# EAGLE design dynafeather (EAGLE 9.6.1)
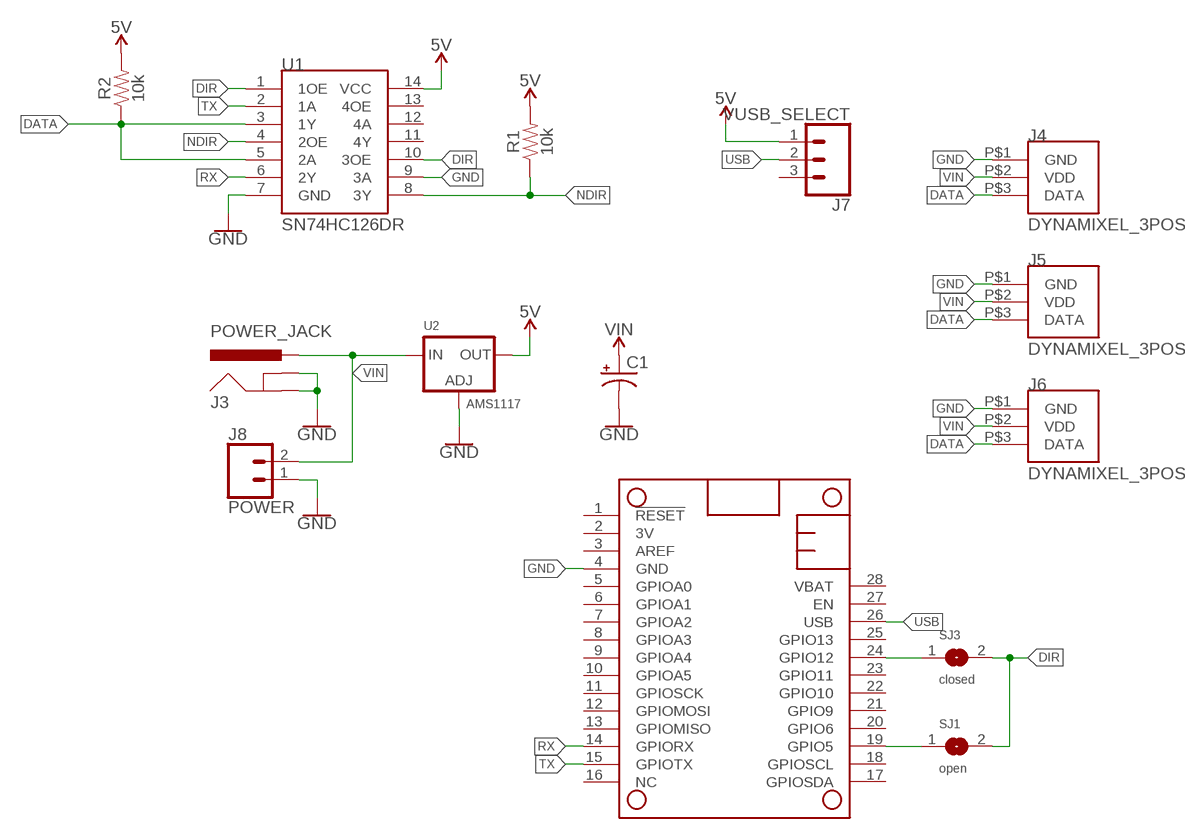
[diagram p0: schematic, sheet 1]

## Parts
C1  ALUM_CAP_0605  [153CLV-0605]
J3  POWER_JACK  [POWER_JACK_PTH]
J4  DYNAMIXEL_3POS  [CONN-MSPOX-3POS]
J5  DYNAMIXEL_3POS  [CONN-MSPOX-3POS]
J6  DYNAMIXEL_3POS  [CONN-MSPOX-3POS]
J7  VUSB_SELECT  CONN_03LOCK  [1X03_LOCK]
J8  POWER  CONN_023.5MM  [SCREWTERMINAL-3.5MM-2]
MS1  FEATHERWING  [FEATHERWING]
R1  10k  10KOHM-0603-1/10W-1%  [0603]
R2  10k  10KOHM-0603-1/10W-1%  [0603]
SJ1  open  SOLDERJUMPERREFLOW  [SOLDERJUMPER_REFLOW]
SJ3  closed  SOLDERJUMPERCLOSED  [SOLDERJUMPER_CLOSEDWIRE]
U1  SN74HC126DR  [SOP14]
U2  AMS1117  LM1117SOT223-REFLOW  [SOT223-R]

## Nets
5V: J7.1 R1.2 R2.2 U1.14(VCC) U2.2(OUT) U2.4(OUT)
DATA: J4.P$3(DATA) J5.P$3(DATA) J6.P$3(DATA) R2.1 U1.3(1Y) U1.5(2A)
DIR: SJ1.2 SJ3.2 U1.1(1OE) U1.10(3OE)
GND: C1.- J3.GND J3.GNDBREAK J4.P$1(GND) J5.P$1(GND) J6.P$1(GND) J8.1 MS1.4(GND) U1.7(GND) U1.9(3A) U2.1(ADJ)
N$3: MS1.24(GPIO12) SJ3.1
N$4: MS1.19(GPIO5) SJ1.1
NDIR: R1.1 U1.4(2OE) U1.8(3Y)
RX: MS1.14(GPIORX) U1.6(2Y)
TX: MS1.15(GPIOTX) U1.2(1A)
USB: J7.2 MS1.26(USB)
VIN: C1.+ J3.PWR J4.P$2(VDD) J5.P$2(VDD) J6.P$2(VDD) J8.2 U2.3(IN)
Unconnected: J7.3 MS1.1(!RESET) MS1.2(3V) MS1.3(AREF) MS1.5(GPIOA0) MS1.6(GPIOA1) MS1.7(GPIOA2) MS1.8(GPIOA3) MS1.9(GPIOA4) MS1.10(GPIOA5) MS1.11(GPIOSCK) MS1.12(GPIOMOSI) MS1.13(GPIOMISO) MS1.16(NC) MS1.17(GPIOSDA) MS1.18(GPIOSCL) MS1.20(GPIO6) MS1.21(GPIO9) MS1.22(GPIO10) MS1.23(GPIO11) MS1.25(GPIO13) MS1.27(EN) MS1.28(VBAT) U1.11(4Y) U1.12(4A) U1.13(4OE)

## Library data of the parts
C1 = HieroLib:ALUM_CAP_0605
J3 = SparkFun-Connectors:POWER_JACK: Power Jack Connector This is the standard 5.5mm barrel jack for power. The PTH is the most common, proven, reliable, footprint. The Slot footprint only works if the mill layer is transmitted to the PCB fab house so be warned. Here are the connectors we sell at SparkFun: DC Barrel Power Jack/Connector <https://www.sparkfun.com/products/119> (PRT-00119) DC Barrel Power Jack/Connector (SMD) <https://www.sparkfun.com/products/12748> (PRT-12748) DC Barrel Jack Adapter - Breadboard Compatible <https://www.sparkfun.com/products/10811> (PRT-10811) It is used on this SparkFun product (and many, many others): SparkFun RedBoard - Programmed with Arduino <https://www.sparkfun.com/products/12757> (DEV-12757) Also, if you need a mating power supply or connector, please check these out: Wall Adapter Power Supply - 9VDC 650mA <https://www.sparkfun.com/products/298> (TOL-00298) DC Barrel Jack Adapter - Male <https://www.sparkfun.com/products/10287> (PRT-10287); PROD_ID: CONN-08197
J4-J6 = HieroLib:DYNAMIXEL_3POS: Dynamixel plug with named pins
J7 = SparkFun-Connectors:CONN_03: Multi connection point. Often used as Generic Header-pin footprint for 0.1 inch spaced/style header connections On any of the 0.1 inch spaced packages, you can populate with these: Break Away Headers - Straight <https://www.sparkfun.com/products/116> (PRT-00116) Break Away Male Headers - Right Angle <https://www.sparkfun.com/products/553> (PRT-00553) Female Headers <https://www.sparkfun.com/products/115> (PRT-00115) Break Away Headers - Machine Pin <https://www.sparkfun.com/products/117> (PRT-00117) Break Away Female Headers - Swiss Machine Pin <https://www.sparkfun.com/products/743> (PRT-00743) Stackable Header - 3 Pin (Female, 0.1") <https://www.sparkfun.com/products/13875> (PRT-13875) For SCREWTERMINALS and SPRING TERMINALS visit here: Screw Terimnals on SparkFun.com <https://www.sparkfun.com/search/results?term=Screw+Terminals> (5mm/3.5mm/2.54mm spacing) This device is also useful as a general connection point to wire up your design to another part of your project. Our various solder wires solder well into these plated through hole pads. Hook-Up Wire - Assortment (Stranded, 22 AWG) <https://www.sparkfun.com/products/11375> (PRT-11375) Hook-Up Wire - Assortment (Solid Core, 22 AWG) <https://www.sparkfun.com/products/11367> (PRT-11367) View the entire wire category on our website here <https://www.sparkfun.com/categories/141> Special notes: Molex polarized connector foot print use with SKU : PRT-08232 with associated crimp pins and housings.
J8 = SparkFun-Connectors:CONN_02: Multi connection point. Often used as Generic Header-pin footprint for 0.1 inch spaced/style header connections On any of the 0.1 inch spaced packages, you can populate with these: Break Away Headers - Straight <https://www.sparkfun.com/products/116> (PRT-00116) Break Away Male Headers - Right Angle <https://www.sparkfun.com/products/553> (PRT-00553) Female Headers <https://www.sparkfun.com/products/115> (PRT-00115) Break Away Headers - Machine Pin <https://www.sparkfun.com/products/117> (PRT-00117) Break Away Female Headers - Swiss Machine Pin <https://www.sparkfun.com/products/743> (PRT-00743) For SCREWTERMINALS and SPRING TERMINALS visit here: Screw Terimnals on SparkFun.com <https://www.sparkfun.com/search/results?term=Screw+Terminals> (5mm/3.5mm/2.54mm spacing) This device is also useful as a general connection point to wire up your design to another part of your project. Our various solder wires solder well into these plated through hole pads. Hook-Up Wire - Assortment (Stranded, 22 AWG) <https://www.sparkfun.com/products/11375> (PRT-11375) Hook-Up Wire - Assortment (Solid Core, 22 AWG) <https://www.sparkfun.com/products/11367> (PRT-11367) View the entire wire category on our website here <https://www.sparkfun.com/categories/141> Special notes: Molex polarized connector foot print use with: PRT-08233 with associated crimp pins and housings. 2.54_SCREWTERM for use with PRT-10571. 3.5mm Screw Terminal footprints for PRT-08084 5mm Screw Terminal footprints for use with PRT-08432; PROD_ID: CONN-08399
MS1 = adafruit:FEATHERWING
R1 R2 = SparkFun-Resistors:10KOHM: 10kΩ resistor A resistor is a passive two-terminal electrical component that implements electrical resistance as a circuit element. Resistors act to reduce current flow, and, at the same time, act to lower voltage levels within circuits. - Wikipedia; PROD_ID: RES-00824
SJ1 SJ3 = microbuilder:SOLDERJUMPER: SMD Solder JUMPER Solder the two pads together to create a connection, or remove the solder to break it. REFLOW - Use this footprint for solder paste and reflow ovens. WAVE - Use this footprint for hand-soldering (larger pads). CLOSED - Has a trace between the two pads to ensure it is closed by default. The trace needs to be cut to disable the jumper, and can be closed again by creating a solder bridge between the two pads.
U1 = HieroLib:SN74HC126DR: Texas Instruments SN74HC126DR DR package = 14 pin SOIC, (Using eagle SOP14) Buffer with output enable
U2 = microbuilder:LM1117: LM1117 Voltage Regulator LM1117 Adjustable Voltage regulator [Digikey: LM1117IMP-ADJDKR-ND] LM1117 3.3V Voltage regulator [AP1117E33GDIDKR-ND] LM1117 5.0V Voltage regulator [AP1117E50GDIDKR-ND] SOT223-REFLOW - SOT223 package for solder paste/reflow ovens SOT223-WAVE - SOT223 package for hand-soldering (larger pads) Note: For the fixed-voltage regulators, simply set the ADJ pin to GND.

## Board
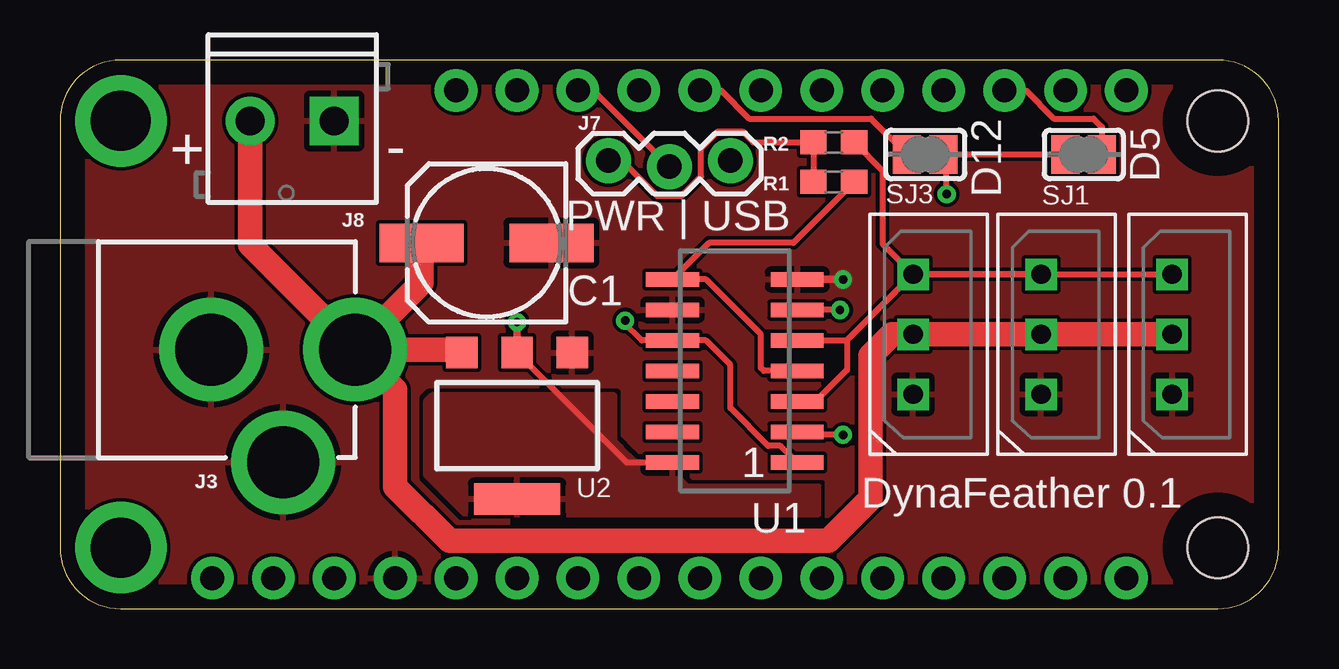
[diagram p1: board, top side]
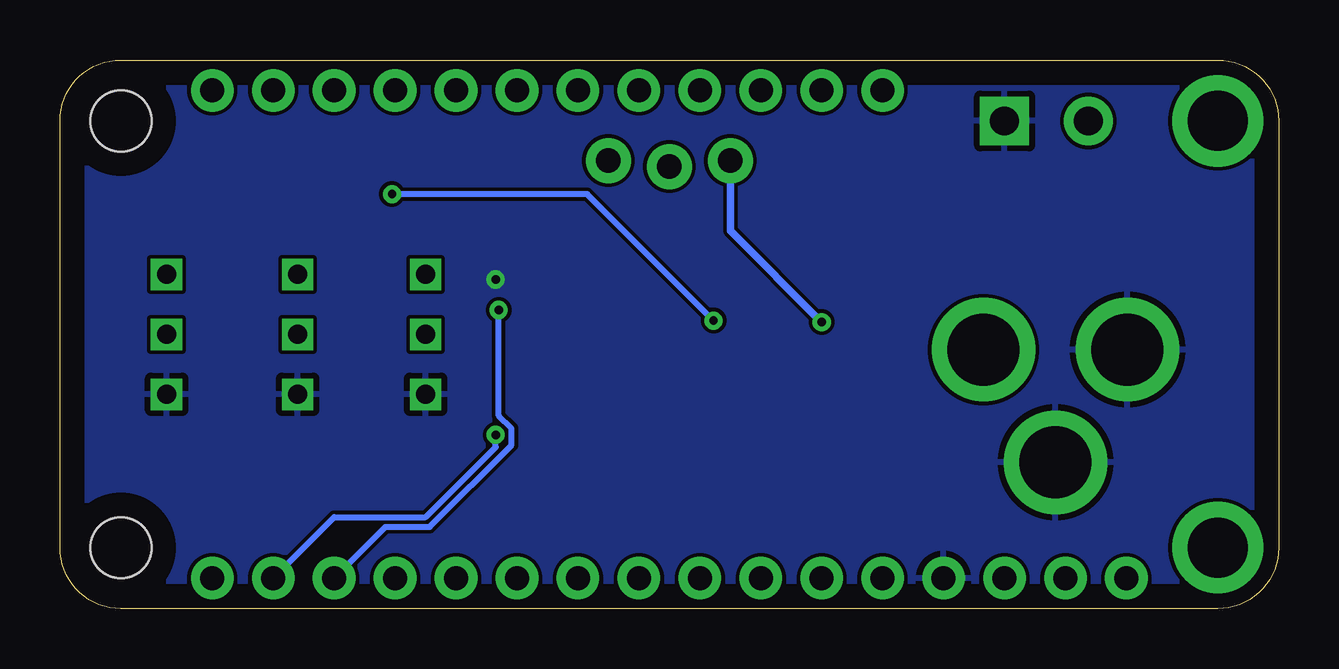
[diagram p2: board, bottom side, seen from below]

Size 50.8 x 22.86 mm. Coordinates in mm from the lower left corner, seen from the top.
Copper layers (1*16): Top 0.035mm / dielectric 1.5mm / Bottom 0.035mm
Design rules "default": minimum track width 6mil, minimum drill 0.35mm, track to track 6mil, track to pad 6mil, pad to pad 6mil, via to via 6mil, smd to smd 6mil, copper to edge 40mil, drill to drill 6mil, minimum pad ring 10mil, minimum via ring 8mil, stop-mask expansion 4mil, vias tented up to drill 0mil, thermal gap 10mil

### Footprints (pad centres in the part's own frame; a part is rotated, then mirrored left to right if it is on the bottom)
153CLV-0605 = smd 3.5 x 1.6: + 2.7,0; - -2.7,0
POWER_JACK_PTH = drill 2.997 pad 4.318: GND 0,7.7; GNDBREAK 4.7,10.7; PWR 0,13.7
CONN-MSPOX-3POS = drill 0.8 square: P$1 -2.5,0; P$2 0,0; P$3 2.5,0
1X03_LOCK = drill 1.016 pad 1.88: 1 0,0.127; 2 2.54,-0.127; 3 5.08,0.127
SCREWTERMINAL-3.5MM-2 = drill 1.2 pad 2.032 square: 1 0,0 | drill 1.2 pad 2.032: 2 3.5,0
FEATHERWING = drill 1 pad 1.778: 1 6.35,1.27; 2 8.89,1.27; 3 11.43,1.27; 4 13.97,1.27; 5 16.51,1.27; 6 19.05,1.27; 7 21.59,1.27; 8 24.13,1.27; 9 26.67,1.27; 10 29.21,1.27; 11 31.75,1.27; 12 34.29,1.27; 13 36.83,1.27; 14 39.37,1.27; 15 41.91,1.27; 16 44.45,1.27; 17 44.45,21.59; 18 41.91,21.59; 19 39.37,21.59; 20 36.83,21.59; 21 34.29,21.59; 22 31.75,21.59; 23 29.21,21.59; 24 26.67,21.59; 25 24.13,21.59; 26 21.59,21.59; 27 19.05,21.59; 28 16.51,21.59 | drill 2.5 pad 3.81: P$1 2.54,20.32; P$2 2.54,2.54 | hole 2.54: 48.26,20.32; 48.26,2.54
0603 = smd 1.1 x 1: 1 -0.85,0; 2 0.85,0
SOLDERJUMPER_REFLOW = smd 1.168 x 1.6: 1 -0.762,0; 2 0.762,0
SOLDERJUMPER_CLOSEDWIRE = smd 1.168 x 1.6: 1 -0.762,0; 2 0.762,0 | smd 0.635 x 0.203: WIRE 0,0
SOP14 = smd 0.6 x 2.2: 1 -3.81,-2.6; 2 -2.54,-2.6; 3 -1.27,-2.6; 4 0,-2.6; 5 1.27,-2.6; 6 2.54,-2.6; 7 3.81,-2.6; 8 3.81,2.6; 9 2.54,2.6; 10 1.27,2.6; 11 0,2.6; 12 -1.27,2.6; 13 -2.54,2.6; 14 -3.81,2.6
SOT223-R = smd 1.3 x 1.3: 1 -2.3,-3.05; 2 0,-3.05; 3 2.3,-3.05 | smd 3.6 x 1.3: 4 0,3.05

### Placement (x,y rotation side)
C1  17.78,15.24 180 top
J3  -1.4,10.79 270 top
J4  35.56,11.43 90 top
J5  40.89,11.43 90 top
J6  46.36,11.43 90 top
J7  22.86,18.54 0 top
J8  11.43,20.32 180 top
MS1  0,0 0 top
R1  32.26,17.78 180 top
R2  32.26,19.43 180 top
SJ1  42.67,18.92 180 top
SJ3  36.07,18.92 0 top
U1  28.13,9.91 90 top
U2  19.05,7.62 180 top

### Tracks (layer width: path | path; a pad name or v marks a point on that pad's centre or on a via)
5V  (via drill 0.35)
  Top 0.254: R1.2 R2.2 28.9,19.43 28.45,19.89 27.43,19.89 26.72,19.17 26.72,18.01 25.9,17.2 24.89,17.2 23.42,18.67 J7.1 | U2.2 23.62,6.1 U1.14
  Top 0.305: U2.2 v19.05,11.94
  Bottom 0.305: v19.05,11.94 22.86,15.75 J7.1
  pour Top: 19.05,8.89 15.49,8.89 15.24,8.64 15.24,5.59 15.37,5.46 16.89,3.94 31.62,3.94 31.62,5.08 26.16,5.08 25.53,5.71 25.53,6.1 24,6.1 23.37,6.73 23.11,6.98 23.11,8.89
DATA
  Top 0.254: U1.5 32.81,11.18 | 32.81,11.18 J4.P$3 | 32.81,11.18 32.81,9.95 31.5,8.64 U1.3 | J4.P$3 J6.P$3 | J5.P$3 J4.P$3 | R2.1 34.29,18.25 34.29,15.2 J4.P$3
DIR  (via drill 0.35)
  Top 0.254: U1.1 30.04,6.79 29.51,6.79 27.94,8.36 27.94,10.16 26.92,11.18 U1.10 24.26,11.18 23.49,11.94 v23.56,12 | SJ1.2 SJ3.2 36.96,18.8 v36.96,17.27
  Bottom 0.254: v23.56,12 28.83,17.27 v36.96,17.27
GND  (via drill 0.35)
  Top 0.305: U1.7 v32.64,13.72
  pour Top (rank 2): 0,22.86 0,0 50.8,0 50.8,22.86
  pour Bottom (rank 2): 0,22.86 0,0 50.8,0 50.8,22.86
N$3
  Top 0.254: SJ3.1 33.81,20.42 28.73,20.42 27.56,21.59 MS1.24
N$4
  Top 0.254: MS1.19 40.26,21.59 41.43,20.42 43.08,20.42 43.43,20.07 SJ1.1
NDIR
  Top 0.254: U1.4 29.34,9.91 29.21,10.03 29.21,11.43 26.92,13.72 U1.8 27.05,15.24 30.57,15.24 R1.1
RX  (via drill 0.35)
  Top 0.254: v32.51,12.45 U1.6
  Bottom 0.254: MS1.14 37.24,3.4 35.39,3.4 31.98,6.81 31.98,7.51 32.51,8.04 v32.51,12.45
TX  (via drill 0.35)
  Top 0.254: v32.64,7.24 30.86,7.24 U1.2
  Bottom 0.254: MS1.15 39.37,3.81 35.56,3.81 32.64,6.73 v32.64,7.24
USB
  Top 0.254: J7.2 22.22,21.59 MS1.26
VIN
  Top 1.016: J8.2 7.93,15.17 J3.PWR | J3.PWR 13.97,9.13 13.97,5.08 16.23,2.82 32.03,2.82 33.78,4.57 33.78,10.54 34.67,11.43 J4.P$2 J5.P$2 J6.P$2 | J3.PWR 16.62,10.79 U2.3 | J3.PWR 15.08,13.57 C1.+

### Text on the board
tPlace: D5 | D12 | PWR | USB | DynaFeather 0.1
tNames: - | +